# EasyEDA Pro project CH585M-R1(3)(1)(5).eprj, schematic CH585M-R1 (3)
Board Name: CH585M-R1 (3); Create Date: 2025-06-02; Page Name: CH585M-R1 (3); Project Name: CH585M-R1(3); Schematic Name: CH585M-R1 (3); Update Date: 2025-07-02; Address1: *; Address2: *; Address3: *; Address4: *; Application_BuildNumber: *; ApprovedBy: *; Author: *; CheckedBy: *; CompanyName: *; CurrentDate: *; CurrentTime: *; Date: *; DocumentFullPathAndName: *; DocumentName: *; DocumentNumber: *; DrawnBy: *; Engineer: *; ImagePath: *; ModifiedDate: *; Organization: *; ProjectName: *; Revision: *; Rule: *; SheetNumber: 1; SheetTotal: 1; Time: *; Title: *
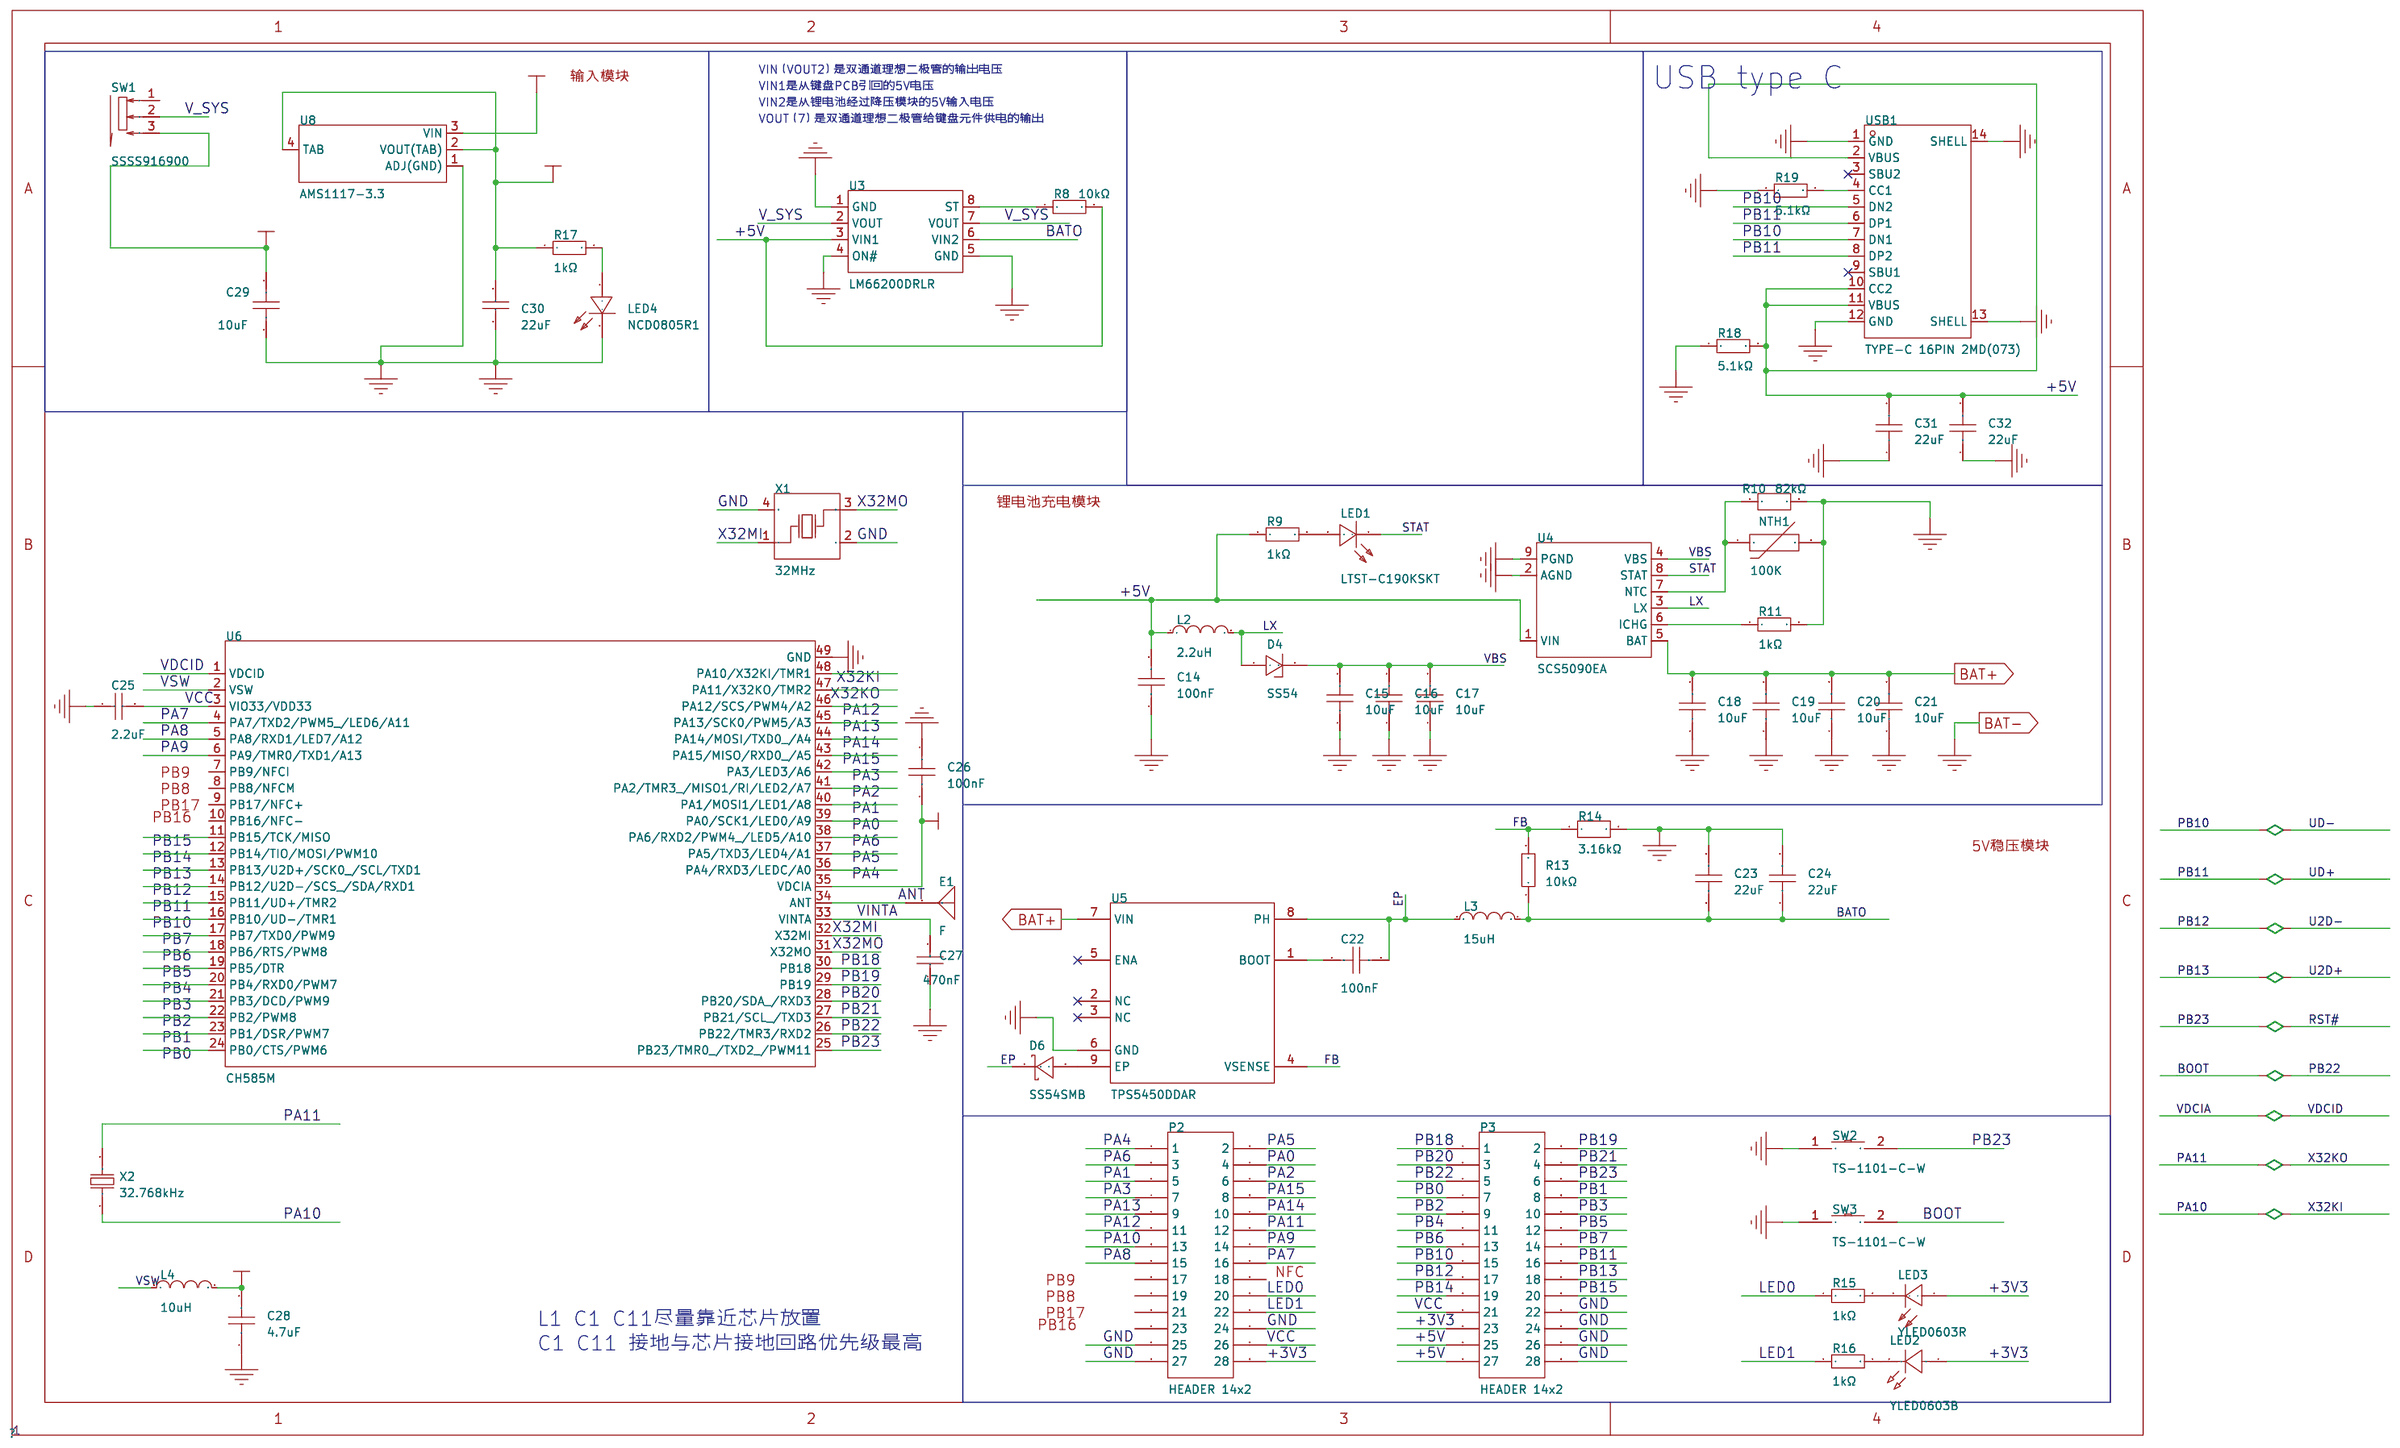
[diagram p1: schematic sheet]

## Parts
C14  100nF  [C0603]
C15  10uF  [C0603]
C16  10uF  [C0603]
C17  10uF  [C0603]
C18  10uF  [C0603]
C19  10uF  [C0603]
C20  10uF  [C0603]
C21  10uF  [C0603]
C22  100nF  [C0603]
C23  22uF  [C0805]
C24  22uF  [C0805]
C25  2.2uF  [C0603]
C26  100nF  [C0603]
C27  470nF  [C0603]
C28  4.7uF  [C0603]
C29  10uF  [C0603]
C30  22uF  [C0603]
C31  22uF  [C0603]
C32  22uF  [C0603]
D4  SS54  [SMA_L4.3-W2.6-LS5.0-FD]
D6  SS54SMB  [SMB_L4.6-W3.6-LS5.3-RD]
E1  F  [ANT-F-1-2.4G-1.6mmFR4]
L2  2.2uH  [IND-SMD_L4.4-W4.2]
L3  15uH  [IND-SMD_L7.0-W6.6_FXL0630]
L4  10uH  [IND-SMD_L7.3-W6.8]
LED1  LTST-C190KSKT  [LED0603-RD]
LED2  YLED0603B  [LED0603-FD]
LED3  YLED0603R  [LED0603-FD]
LED4  NCD0805R1  [LED0805-R-RD]
NTH1  100K  [RES-TH_L2.5-W2.5-P1.70-D0.3]
P2  HEADER 14x2  [IDC28-2.54MM]
P3  HEADER 14x2  [IDC28-2.54MM]
R8  10kΩ  [R0603]
R9  1kΩ  [R0603]
R10  82kΩ  [R0603]
R11  1kΩ  [R0603]
R13  10kΩ  [R0603]
R14  3.16kΩ  [R0603]
R15  1kΩ  [R0603]
R16  1kΩ  [R0603]
R17  1kΩ  [R0603]
R18  5.1kΩ  [R0603]
R19  5.1kΩ  [R0603]
SW1  SSSS916900  [SW-TH_SSSS916900]
SW2  TS-1101-C-W  [SW-SMD_L6.0-W3.3-LS8.0]
SW3  TS-1101-C-W  [SW-SMD_L6.0-W3.3-LS8.0]
U3  LM66200DRLR  [SOT-583-8_L2.1-W1.2-P0.50-LS1.6-BL]
U4  SCS5090EA  [ESOP-8_L4.9-W3.9-P1.27-LS6.0-BL-EP3.3]
U5  TPS5450DDAR  [SOP-8_L4.9-W3.9-P1.27-LS6.0-BL-EP]
U6  CH585M  [QFN-48_L5.0-W5.0-P0.35-TL-EP3.7-1]
U8  AMS1117-3.3  [SOT-223-4_L6.5-W3.5-P2.30-LS7.0-BR]
USB1  TYPE-C 16PIN 2MD(073)  [USB-C-SMD_TYPE-C-6PIN-2MD-073]
X1  32MHz  [CRYSTAL-SMD_4P-L3.2-W2.5-BL]
X2  32.768kHz  [FC-135R_L3.2-W1.5]

## Library data of the parts
C14 C22 C26 = CGA0603X7R104K500JT: 容值:100nF;精度:±10%;额定电压:50V;温度系数:X7R;; LCSC Part Name: 100nF ±10% 50V; Supplier Part: C6119867; Manufacturer: HRE(芯声); Supplier Footprint: 0603; JLCPCB Part Class: 扩展库; Datasheet: https://atta.szlcsc.com/upload/public/pdf/source/20250103/C44077DA9E7B3EFAE02F22B6D3D1CBC9.pdf; Supplier: LCSC; Tolerance: ±10%; Voltage Rating: 50V; Temperature Coefficient: X7R
C15-C21 C29 = CGA0603X5R106K100JT: 容值:10uF;精度:±10%;额定电压:10V;温度系数:X5R;; LCSC Part Name: 10uF ±10% 10V; Supplier Part: C6119842; Manufacturer: HRE(芯声); Supplier Footprint: 0603; JLCPCB Part Class: 扩展库; Supplier: LCSC; Tolerance: ±10%; Voltage Rating: 10V; Temperature Coefficient: X5R
C23 C24 = CGA0805X5R226M350MT: 容值:22uF;精度:±20%;额定电压:35V;材质(温度系数):X5R;; LCSC Part Name: 22uF ±20% 35V; Supplier Part: C6119901; Manufacturer: HRE(芯声); Supplier Footprint: 0805; JLCPCB Part Class: 扩展库; Datasheet: https://atta.szlcsc.com/upload/public/pdf/source/20231129/D589D0CC4D260F7AC3A77E53B455CCB3.pdf; Supplier: LCSC; Tolerance: ±20%; Voltage Rated: 35V; Temperature Coefficient: X5R
C25 C30 = CL10A225KO8NNNC: 容值:2.2uF;精度:±10%;额定电压:16V;材质(温度系数):X5R;; LCSC Part Name: 2.2uF ±10% 16V; Supplier Part: C23630; Manufacturer: SAMSUNG(三星); Supplier Footprint: 0603; JLCPCB Part Class: 基础库; Datasheet: https://atta.szlcsc.com/upload/public/pdf/source/20160218/1457707763339.pdf; Supplier: LCSC; Tolerance: ±10%; Voltage Rated: 16V; Temperature Coefficient: X5R
C27 = CL10B474KA8NNNC: 容值:470nF;精度:±10%;额定电压:25V;材质(温度系数):X7R;; LCSC Part Name: 470nF ±10% 25V; Supplier Part: C1623; Manufacturer: SAMSUNG(三星); Supplier Footprint: 0603; JLCPCB Part Class: 基础库; Datasheet: https://atta.szlcsc.com/upload/public/pdf/source/20160218/1457707763339.pdf; Supplier: LCSC; Tolerance: ±10%; Voltage Rated: 25V; Temperature Coefficient: X7R
C28 = CL10A475KO8NNNC: 容值:4.7uF;精度:±10%;额定电压:16V;材质(温度系数):X5R;; LCSC Part Name: 4.7uF ±10% 16V; Supplier Part: C19666; Manufacturer: SAMSUNG(三星); Supplier Footprint: 0603; JLCPCB Part Class: 基础库; Datasheet: https://atta.szlcsc.com/upload/public/pdf/source/20160218/1457707763339.pdf; Supplier: LCSC; Tolerance: ±10%; Voltage Rated: 16V; Temperature Coefficient: X5R
C31 C32 = CGA0603X5R226M160JT: 容值:22uF;精度:±20%;额定电压:16V;温度系数:X5R;; LCSC Part Name: 22uF ±20% 16V; Supplier Part: C6119868; Manufacturer: HRE(芯声); Supplier Footprint: 0603; JLCPCB Part Class: 扩展库; Datasheet: https://atta.szlcsc.com/upload/public/pdf/source/20250121/36E435B8815E1026A710792D223DB526.pdf; Supplier: LCSC; Tolerance: ±20%; Voltage Rating: 16V; Temperature Coefficient: X5R
D4 = SS54_C7420369: 二极管配置:独立式;正向压降(Vf):550mV@5.0A;直流反向耐压(Vr):40V;整流电流:5A;; LCSC Part Name: 电压:40V 电流:5A; Supplier Part: C7420369; Manufacturer: 宏迦橙; Supplier Footprint: SMA(DO-214AC); JLCPCB Part Class: 扩展库; Datasheet: https://atta.szlcsc.com/upload/public/pdf/source/20230828/254C3882F8647358AD9F60DD73611B5E.pdf; Supplier: LCSC; Diode Configuration: 独立式; Forward Voltage (Vf@If): 550mV@5.0A; Reverse Voltage (Vr): 40V; Rectified Current: 5A; Reverse Leakage Current (Ir): 50uA@40V
D6 = SS54SMB: 正向压降(Vf):550mV@5A;直流反向耐压(Vr):40V;整流电流:5A;; LCSC Part Name: 电压:40V 电流:5A; Supplier Part: C511854; Manufacturer: BORN(伯恩半导体); Supplier Footprint: SMB; JLCPCB Part Class: 扩展库; Datasheet: https://atta.szlcsc.com/upload/public/pdf/source/20240618/EC76FBA1B551339A29573F75E350BD40.pdf; Supplier: LCSC; Voltage - Forward(Vf@If): 550mV@5A; Voltage - DC Reverse(Vr): 40V; Current - Rectified: 5A
E1 = ANTENNA: Generic Antenna; Library Name: *
L2 = FXL0420-2R2-M: 电感值:2.2uH;精度:±20%;额定电流:4.5A;饱和电流(Isat):5A;类型:一体成型电感;; LCSC Part Name: 2.2uH ±20% 5A; Supplier Part: C167206; Manufacturer: cjiang(长江微电); Supplier Footprint: SMD,4.2x4.4mm; JLCPCB Part Class: 扩展库; Datasheet: https://atta.szlcsc.com/upload/public/pdf/source/20240426/3189EA8206330E2108542F9E34E540E7.pdf; Supplier: LCSC; Tolerance: ±20%; Rated Current: 4.5A; Saturation Current (Isat): 5A; DC Resistance (DCR): 58mΩ; Type: 一体成型电感
L3 = FXL0630-150-M: 电感值:15uH;精度:±20%;额定电流:3A;饱和电流(Isat):4.5A;类型:一体成型电感;; LCSC Part Name: 15uH ±20% 4.5A; Supplier Part: C177243; Manufacturer: cjiang(长江微电); Supplier Footprint: SMD,6.6x7mm; JLCPCB Part Class: 扩展库; Datasheet: https://atta.szlcsc.com/upload/public/pdf/source/20240426/3189EA8206330E2108542F9E34E540E7.pdf; Supplier: LCSC; Tolerance: ±20%; Rated Current: 3A; Saturation Current (Isat): 4.5A; DC Resistance (DCR): 115mΩ; Type: 一体成型电感
L4 = FXL0630-100-M: 电感值:10uH;精度:±20%;额定电流:4.5A;饱和电流(Isat):5.5A;类型:一体成型电感;; LCSC Part Name: 10uH ±20% 5.5A; Supplier Part: C167223; Manufacturer: cjiang(长江微电); Supplier Footprint: SMD,6.6x7mm; JLCPCB Part Class: 扩展库; Datasheet: https://atta.szlcsc.com/upload/public/pdf/source/20240426/3189EA8206330E2108542F9E34E540E7.pdf; Supplier: LCSC; Tolerance: ±20%; Rated Current: 4.5A; Saturation Current (Isat): 5.5A; DC Resistance (DCR): 68mΩ; Type: 一体成型电感
LED1 = LTST-C190KSKT: 发光颜色:黄色;正向电压(VF):2.1V;功率:75mW;正向电流:20mA;主波长:584.5nm~597nm;二极管配置:-;透镜颜色:无色透明透镜;色温:-;发光强度:104mcd;发光角度:130°;载带方式:-;工作温度:-30℃~+85℃;; LCSC Part Name: 黄灯; Supplier Part: C125095; Manufacturer: LITEON(光宝); Supplier Footprint: 0603; JLCPCB Part Class: 扩展库; Datasheet: https://atta.szlcsc.com/upload/public/pdf/source/20180129/C125095_15171881843821315881.pdf; Supplier: LCSC; Emitted Color: 黄色; Forward Voltage (VF): 2.1V; Power Dissipation: 75mW; Forward Current: 20mA; Dominant Wavelength: 584.5nm~597nm; Peak Wavelength: 588nm; Lens Color: 无色透明透镜; Luminous Intensity: 104mcd; Viewing Angle: 130°; Operating Temperature: -30℃~+85℃
LED2 = YLED0603B: 发光颜色:蓝色;正向电压(VF):2.6V~3.2V;功率:-;正向电流:30mA;主波长:460nm~475nm;发光角度:120°;工作温度:-40℃~+85℃;; Supplier Part: C19171394; Manufacturer: YONGYUTAI(永裕泰); Supplier Footprint: 0603; JLCPCB Part Class: 扩展库; Datasheet: https://atta.szlcsc.com/upload/public/pdf/source/20231027/6134FF4BA718E32A802654BBC76F69A6.pdf; Supplier: LCSC; Emitted Color: 蓝色; Forward Voltage (VF): 2.6V~3.2V; Forward Current: 30mA; Dominant Wavelength: 460nm~475nm; Viewing Angle: 120°; Operating Temperature: -40℃~+85℃
LED3 = YLED0603R: 发光颜色:红色;正向电压(VF):1.8V~2.4V;功率:-;正向电流:25mA;主波长:620nm~625nm;二极管配置:-;透镜颜色:-;色温:-;发光强度:-;发光角度:-;载带方式:-;工作温度:-40℃~+85℃;; Supplier Part: C19171390; Manufacturer: YONGYUTAI(永裕泰); Supplier Footprint: 0603; JLCPCB Part Class: 扩展库; Datasheet: https://atta.szlcsc.com/upload/public/pdf/source/20231027/FB19AF06E2C70028E58AB5CEDD1BDC72.pdf; Supplier: LCSC; Emitted Color: 红色; Forward Voltage (VF): 1.8V~2.4V; Forward Current: 25mA; Dominant Wavelength: 620nm~625nm; Operating Temperature: -40℃~+85℃
LED4 = NCD0805R1: 灯头类型:-;发光颜色:红色;正向电压(VF):1.6V~2.6V;功率:65mW;正向电流:20mA;主波长:615nm~630nm;二极管配置:独立二极管;透镜颜色:无色透明透镜;色温:-;发光强度:67mcd~195mcd;发光角度:130°;载带方式:-;工作温度:-30℃~+85℃;; Supplier Part: C84256; Manufacturer: 国星光电; Supplier Footprint: 0805; JLCPCB Part Class: 基础库; Datasheet: https://atta.szlcsc.com/upload/public/pdf/source/20200820/C84256_F0A75A43B3EAD75808600A0514C76B99.pdf; Supplier: LCSC; Emitted Color: 红色; Forward Voltage (VF): 1.6V~2.6V; Power Dissipation: 65mW; Forward Current: 20mA; Dominant Wavelength: 615nm~630nm; Diode Configuration: 独立二极管; Lens Color: 无色透明透镜; Luminous Intensity: 67mcd~195mcd; Viewing Angle: 130°; Operating Temperature: -30℃~+85℃
NTH1 = MF52A104F3950 (A1): 阻值:100kΩ;B值(25℃/50℃):3950K;功率:50mW;B值精度:±1%;最大稳态电流(25℃):-;; Supplier Part: C13424; Manufacturer: 时恒; Supplier Footprint: 插件,P=1.7mm; JLCPCB Part Class: 扩展库; Datasheet: https://atta.szlcsc.com/upload/public/pdf/source/20160329/1459215857724.pdf; Supplier: LCSC; Resistance @ 25℃: 100kΩ; B Constant (25℃/50℃): 3950K; Power(Watts): 50mW; B Constant Tolerance: ±1%; Operating Temperature: -55℃~+125℃
P2 P3 = HEADER 14x2: Header, 14-Pin, Dual row; Library Name: wch_sch_others
R8 R13 = 0603WAF1002T5E: 电阻类型:厚膜电阻;阻值:10kΩ;精度:±1%;功率:100mW;工作电压:75V;温度系数:±100ppm/℃;; LCSC Part Name: 厚膜电阻 10kΩ ±1% 100mW; Supplier Part: C25804; Manufacturer: UNI-ROYAL(厚声); Supplier Footprint: 0603; JLCPCB Part Class: 基础库; Datasheet: https://atta.szlcsc.com/upload/public/pdf/source/20200306/C422600_1E6D84923E4A46A82E41ADD87F860B5C.pdf; Supplier: LCSC; Type: 厚膜电阻; Tolerance: ±1%; Power(Watts): 100mW; Voltage-Supply(Max): 75V; Temperature Coefficient: ±100ppm/℃; Operating Temperature: -55℃~+155℃
R9 R11 R15-R17 = 0603WAF1001T5E: 电阻类型:厚膜电阻;阻值:1kΩ;精度:±1%;功率:100mW;最大工作电压:75V;温度系数:±100ppm/℃;; LCSC Part Name: 1kΩ ±1% 100mW 厚膜电阻; Supplier Part: C21190; Manufacturer: UNI-ROYAL(厚声); Supplier Footprint: 0603; JLCPCB Part Class: 基础库; Datasheet: https://atta.szlcsc.com/upload/public/pdf/source/20200306/C422600_1E6D84923E4A46A82E41ADD87F860B5C.pdf; Supplier: LCSC; Type: 厚膜电阻; Tolerance: ±1%; Power(Watts): 100mW; Overload Voltage (Max): 75V; Temperature Coefficient: ±100ppm/℃; Operating Temperature Range: -55℃~+155℃
R10 = FRC0603F8202TS: 电阻类型:厚膜电阻;阻值:82kΩ;精度:±1%;功率:100mW;工作电压:75V;温度系数:±100ppm/℃;; LCSC Part Name: 82kΩ ±1% 100mW 厚膜电阻; Supplier Part: C2907072; Manufacturer: FOJAN(富捷); Supplier Footprint: 0603; JLCPCB Part Class: 扩展库; Datasheet: https://atta.szlcsc.com/upload/public/pdf/source/20211221/925EC7D7225764EE0046F22065062C87.pdf; Supplier: LCSC; Type: 厚膜电阻; Tolerance: ±1%; Power(Watts): 100mW; Voltage-Supply(Max): 75V; Temperature Coefficient: ±100ppm/℃; Operating Temperature: -55℃~+155℃
R14 = FRC0603F3161TS: 电阻类型:厚膜电阻;阻值:3.16kΩ;精度:±1%;功率:100mW;最大工作电压:75V;温度系数:±100ppm/℃;; LCSC Part Name: 3.16kΩ ±1% 100mW 厚膜电阻; Supplier Part: C2930087; Manufacturer: FOJAN(富捷); Supplier Footprint: 0603; JLCPCB Part Class: 扩展库; Datasheet: https://atta.szlcsc.com/upload/public/pdf/source/20211221/925EC7D7225764EE0046F22065062C87.pdf; Supplier: LCSC; Type: 厚膜电阻; Tolerance: ±1%; Power(Watts): 100mW; Overload Voltage (Max): 75V; Temperature Coefficient: ±100ppm/℃; Operating Temperature Range: -55℃~+155℃
R18 R19 = 0603WAF5101T5E: 电阻类型:厚膜电阻;阻值:5.1kΩ;精度:±1%;功率:100mW;最大工作电压:75V;温度系数:±100ppm/℃;; LCSC Part Name: 5.1kΩ ±1% 100mW 厚膜电阻; Supplier Part: C23186; Manufacturer: UNI-ROYAL(厚声); Supplier Footprint: 0603; JLCPCB Part Class: 基础库; Datasheet: https://atta.szlcsc.com/upload/public/pdf/source/20200306/C422600_1E6D84923E4A46A82E41ADD87F860B5C.pdf; Supplier: LCSC; Type: 厚膜电阻; Tolerance: ±1%; Power(Watts): 100mW; Overload Voltage (Max): 75V; Temperature Coefficient: ±100ppm/℃; Operating Temperature Range: -55℃~+155℃
SW1 = SSSS916900: 电路结构:单刀双掷;安装方式:侧插;额定电流(DC):100mA;额定电压(DC):12V;额定电流(AC):-;额定电压(AC):-;机械寿命:1万次;; LCSC Part Name: 11.5*3.7*5 立式、滑动、直角; Supplier Part: C125053; Manufacturer: ALPSALPINE(阿尔卑斯阿尔派); Supplier Footprint: 插件; JLCPCB Part Class: 扩展库; Datasheet: https://atta.szlcsc.com/upload/public/pdf/source/20170810/C125053_1502335349112879915.pdf; Supplier: LCSC; Circuit: 单刀双掷; Actuator Style: 矩形柱状; Pin Style: PC引脚; Switch Height: 7.7mm; Mounting Style: 侧插; Current Rating (DC): 100mA; Voltage Rating (DC): 12V; Mechanical Life: 1万次; Operating Temperature: -40℃~+85℃
SW2 SW3 = TS-1101-C-W: 电路结构:单刀单掷;按钮形状:矩形按钮;作用力:260gf;安装方式:立贴;开关长度:6mm;开关宽度:3.6mm;开关高度:2.5mm;带支架:不带;触点电流:50mA;额定电压(AC):-;额定电压(DC):12V;额定功率:-;绝缘电阻:-;带灯:无;机械寿命:5万次;; LCSC Part Name: 6*3.6*2.5mm 立贴 轻触开关; Supplier Part: C318938; Manufacturer: XKB Connectivity(中国星坤); Supplier Footprint: SMD; JLCPCB Part Class: 扩展库; Datasheet: https://atta.szlcsc.com/upload/public/pdf/source/20200227/C318938_C2E53B1EEDE37D980A33616AC086DE53.pdf; Supplier: LCSC; Circuit: 单刀单掷; Actuator Style: 矩形按钮; Operating Force: 260gf; Mounting Style: 立贴; Switch Length: 6mm; Switch Width: 3.6mm; Switch Height: 2.5mm; Strike Gundam: 不带; Contact Current: 50mA; Voltage Rating (DC): 12V; Actuator/Cap Color: 白色带淡绿; With Lamp: 无; Mechanical Life: 5万次; Operating Temperature: -30℃~+85℃
U3 = LM66200DRLR: LM66200 1.6V 至 5.5V、40mΩ、2.5A、低 IQ、双输入理想二极管; Supplier Part: C3235556; Manufacturer: TI(德州仪器); Supplier Footprint: SOT-583; JLCPCB Part Class: 扩展库; Datasheet: https://www.ti.com/cn/lit/gpn/lm66200; Supplier: LCSC
U4 = SCS5090EA: Supplier Part: C46628685; Manufacturer: JSMSEMI(杰盛微); Supplier Footprint: ESOP-8; JLCPCB Part Class: 扩展库; Datasheet: https://atta.szlcsc.com/upload/public/pdf/source/20250430/5D0C5A452977378E7024C91D7958238C.pdf; Supplier: LCSC
U5 = TPS5450DDAR: 功能类型:降压型;输出类型:可调;工作电压:5.5V~36V;输出电压:1.221V~31.32V;输出电流:5A;; LCSC Part Name: 5A宽输入范围降压转换器; Supplier Part: C114425; Manufacturer: TI(德州仪器); Supplier Footprint: SOP-8-EP-150mil; JLCPCB Part Class: 扩展库; Datasheet: https://www.ti.com/cn/lit/gpn/tps5450; Supplier: LCSC; Function: 降压型; Output Type: 可调; Input Voltage: 5.5V~36V; Output Voltage: 1.221V~31.32V; Output Current: 5A; Switching Frequency: 500kHz; Operating Temperature: -40℃~+125℃@(TJ); Synchronous Rectification: 否; Number of Outputs: 1; Topology: 降压式; Switch tube (built-in/external): 内置
U6 = CH585M_C42381469: 支持BLE5.4、自定义高性能2.4G协议、高速USB内置PHY及NFC的RISC-V内核无线SoC。集成段式LCD、LED、防水级触摸按键等外设，可单芯片构建各类低功耗专业无线应用。; Supplier Part: C42381469; Manufacturer: WCH(南京沁恒); Supplier Footprint: QFN-48-EP(5x5); JLCPCB Part Class: 扩展库; Datasheet: https://atta.szlcsc.com/upload/public/pdf/source/20250424/61810E7F7CF7AA97D855AFB809BFC2C7.pdf; Supplier: LCSC
U8 = AMS1117-3.3_C347222: 输出类型:固定;工作电压:12V;输出电压:3.3V;输出电流:1A;电源纹波抑制比(PSRR):60dB@(120Hz);输出极性:正极;; LCSC Part Name: 输出:3.3V 电流:1A 耐压:12V; Supplier Part: C347222; Manufacturer: UMW(友台半导体); Supplier Footprint: SOT-223; JLCPCB Part Class: 扩展库; Datasheet: https://atta.szlcsc.com/upload/public/pdf/source/20241218/BAF0263FA2E44BCD8AF41AA4FA04EFAA.pdf; Supplier: LCSC; Output Type: 固定; Voltage - Supply: 12V; Output Voltage: 3.3V; Output Current: 1A; Power Supply Rejection Ratio (PSRR): 60dB@(120Hz); Voltage Dropout: 1.3V@(1A); Features: 过流保护; Output Configuration: 正极; Number of Outputs: 1
USB1 = TYPE-C 16PIN 2MD(073): 连接器类型:Type-C;协议标准:USB 3.1;公母:母;安装方式:卧贴;触点数量:16P;端口数量:1;额定电流 - 电源:3A;工作温度:-25℃~+85℃;; LCSC Part Name: Type-C 母 卧贴; Supplier Part: C2765186; Manufacturer: SHOU HAN(首韩); Supplier Footprint: SMD; JLCPCB Part Class: 扩展库; Datasheet: https://atta.szlcsc.com/upload/public/pdf/source/20250506/FFB74EDFDFA0AC372CE4A8E4F739CCEF.pdf; Supplier: LCSC; Connector Type: Type-C; Protocol Standard: USB 3.1; Gender: 母; Mounting Type: 卧贴; Number of Contacts: 16P; Number of Ports: 1; Current Rating-Power: 3A; Voltage Rating: 5V; Connect-Disconnect Life: 5千次; Detection color: 黑色; Operating Temperature: -25℃~+85℃
X1 = X322532MOB4SI: 晶振类型:贴片晶振;频率:32MHz;常温频差:±10ppm;负载电容:12pF;频率稳定度:±20ppm;; LCSC Part Name: YSX321SL 32MHZ 4P 3225 12PF ±10PPM -40~85℃ (±20PPM); Supplier Part: C9009; Manufacturer: YXC(扬兴晶振); Supplier Footprint: SMD3225-4P; JLCPCB Part Class: 扩展库; Datasheet: https://atta.szlcsc.com/upload/public/pdf/source/20240329/19D5F850207469550BEB00D7DFEDBC7A.pdf; Supplier: LCSC; Type: 贴片晶振; Normal temperature Frequency Tolerance: ±10ppm; Load Capacitance: 12pF; Frequency Stability: ±20ppm; Operating Temperature: -40℃~+85℃
X2 = Q13FC13500004_C32346: 晶振类型:贴片晶振;频率:32.768kHz;常温频差:±20ppm;负载电容:12.5pF;; LCSC Part Name: 32.768kHz ±20ppm 12.5pF; Supplier Part: C32346; Manufacturer: EPSON(爱普生); Manufacturer Part: Q13FC13500004; Supplier Footprint: SMD3215-2P; JLCPCB Part Class: 基础库; Datasheet: https://atta.szlcsc.com/upload/public/pdf/source/20240418/0E0FF5F0356BA3753F616001439D1416.pdf; Supplier: LCSC; Crystal Type: 贴片晶振; Normal temperature Frequency Tolerance: ±20ppm; Load Capacitor: 12.5pF; Equivalent Series Resistance (ESR): 70kΩ; Operating Temperature: -40℃~+85℃

## Nets
+3V3: C30.2 LED2.1(A) LED3.1(+) P2.28 P3.23 R17.1 U8.2(VOUT(TAB)) U8.4(TAB)
+5V: C14.2 C31.2 C32.2 L2.1 P3.25 P3.27 R8.2 R9.1 R18.2 U3.3(VIN1) U4.1(VIN) USB1.2(VBUS) USB1.10(CC2) USB1.11(VBUS)
GND: C14.1 C15.1 C16.1 C17.1 C18.1 C19.1 C20.1 C21.1 C23.2 C24.2 C25.1 C26.2 C27.1 C28.1 C29.1 C30.1 C31.1 C32.1 LED4.2(-) NTH1.2 P2.24 P2.25 P2.27 P3.22 P3.24 P3.26 P3.28 R10.2 R11.2 R14.2 R18.1 R19.1 SW2.1 SW3.1 U3.1(GND) U3.4(ON#) U3.5(GND) U4.2(AGND) U4.9(PGND) U5.6(GND) U6.49(GND) U8.1(ADJ(GND)) USB1.1(GND) USB1.12(GND) USB1.13(SHELL) USB1.14(SHELL) X1.2(GND) X1.4(GND)
V5V: C29.2 SW1.3 U8.3(VIN)
VCC: C25.2 P2.26 P3.21 U6.3(VIO33/VDD33)
VINTA: C27.2 U6.33(VINTA)
ANT: E1.1(A) U6.34(ANT)
BAT+: C18.2 C19.2 C20.2 C21.2 U4.5(BAT) U5.7(VIN)
BATO: C23.1 C24.1 L3.2 R13.1 U3.6(VIN2)
BOOT: P3.5 SW3.2 U6.26(PB22/TMR3/RXD2)
EP: C22.2 D6.1(K) L3.1 U5.8(PH)
FB: R13.2 R14.1 U5.4(VSENSE)
LED0: P2.20 R15.1
LED1: P2.22 R16.1
LX: D4.1(A) L2.2 U4.3(LX)
PA0: P2.4 U6.39(PA0/SCK1/LED0/A9)
PA1: P2.5 U6.40(PA1/MOSI1/LED1/A8)
PA2: P2.6 U6.41(PA2/TMR3_/MISO1/RI/LED2/A7)
PA3: P2.7 U6.42(PA3/LED3/A6)
PA4: P2.1 U6.36(PA4/RXD3/LEDC/A0)
PA5: P2.2 U6.37(PA5/TXD3/LED4/A1)
PA6: P2.3 U6.38(PA6/RXD2/PWM4_/LED5/A10)
PA7: P2.16 U6.4(PA7/TXD2/PWM5_/LED6/A11)
PA8: P2.15 U6.5(PA8/RXD1/LED7/A12)
PA9: P2.14 U6.6(PA9/TMR0/TXD1/A13)
PA10: P2.13 U6.48(PA10/X32KI/TMR1) X2.1
PA11: P2.12 U6.47(PA11/X32KO/TMR2) X2.2
PA12: P2.11 U6.46(PA12/SCS/PWM4/A2)
PA13: P2.9 U6.45(PA13/SCK0/PWM5/A3)
PA14: P2.10 U6.44(PA14/MOSI/TXD0_/A4)
PA15: P2.8 U6.43(PA15/MISO/RXD0_/A5)
PB0: P3.7 U6.24(PB0/CTS/PWM6)
PB1: P3.8 U6.23(PB1/DSR/PWM7)
PB2: P3.9 U6.22(PB2/PWM8)
PB3: P3.10 U6.21(PB3/DCD/PWM9)
PB4: P3.11 U6.20(PB4/RXD0/PWM7)
PB5: P3.12 U6.19(PB5/DTR)
PB6: P3.13 U6.18(PB6/RTS/PWM8)
PB7: P3.14 U6.17(PB7/TXD0/PWM9)
PB10: P3.15 U6.16(PB10/UD-/TMR1) USB1.5(DN2) USB1.7(DN1)
PB11: P3.16 U6.15(PB11/UD+/TMR2) USB1.6(DP1) USB1.8(DP2)
PB12: P3.17 U6.14(PB12/U2D-/SCS_/SDA/RXD1)
PB13: P3.18 U6.13(PB13/U2D+/SCK0_/SCL/TXD1)
PB14: P3.19 U6.12(PB14/TIO/MOSI/PWM10)
PB15: P3.20 U6.11(PB15/TCK/MISO)
PB18: P3.1 U6.30(PB18)
PB19: P3.2 U6.29(PB19)
PB20: P3.3 U6.28(PB20/SDA_/RXD3)
PB21: P3.4 U6.27(PB21/SCL_/TXD3)
PB23: P3.6 SW2.2 U6.25(PB23/TMR0_/TXD2_/PWM11)
STAT: LED1.1(-) U4.8(STAT)
V_SYS: SW1.2 U3.2(VOUT) U3.7(VOUT)
VBS: C15.2 C16.2 C17.2 D4.2(K) U4.4(VBS)
VDCID: C26.1 C28.2 L4.2 U6.1(VDCID) U6.35(VDCIA)
VSW: L4.1 U6.2(VSW)
X32MI: U6.32(X32MI) X1.1(OSC1)
X32MO: U6.31(X32MO) X1.3(OSC2)
$1N164: LED4.1(+) R17.2
$1N5275: R8.1 U3.8(ST)
$1N7704: LED1.2(+) R9.2
$1N7911: NTH1.1 R10.1 U4.7(NTC)
$1N8019: R11.1 U4.6(ICHG)
$1N8947: C22.1 U5.1(BOOT)
$1N8982: D6.2(A) U5.9(EP)
$1N12468: LED3.2(-) R15.2
$1N12470: LED2.2(K) R16.2
$1N14257: R19.2 USB1.4(CC1)

Not connected (* = marked no-connect by the designer): P2 17 18 19 21 23; SW1 1; U5 2(NC)* 3(NC)* 5(ENA)*; U6 7(PB9/NFCI) 8(PB8/NFCM) 9(PB17/NFC+) 10(PB16/NFC-); USB1 3(SBU2)* 9(SBU1)*

## Notes on the sheet
- VIN（VOUT2）是双通道理想二极管的输出电压
- 输入模块
- VIN1是从键盘PCB引回的5V电压
- USB type C
- VIN2是从锂电池经过降压模块的5V输入电压
- VOUT（7）是双通道理想二极管给键盘元件供电的输出
- 锂电池充电模块
- PB9
- PB17
- PB8
- PB16
- 5V稳压模块
- PB9
- NFC
- PB8
- L1 C1 C11尽量靠近芯片放置
- PB17
- PB16
- C1 C11 接地与芯片接地回路优先级最高
